# EAGLE design IotaWatt4.8 (EAGLE 7.7.0)
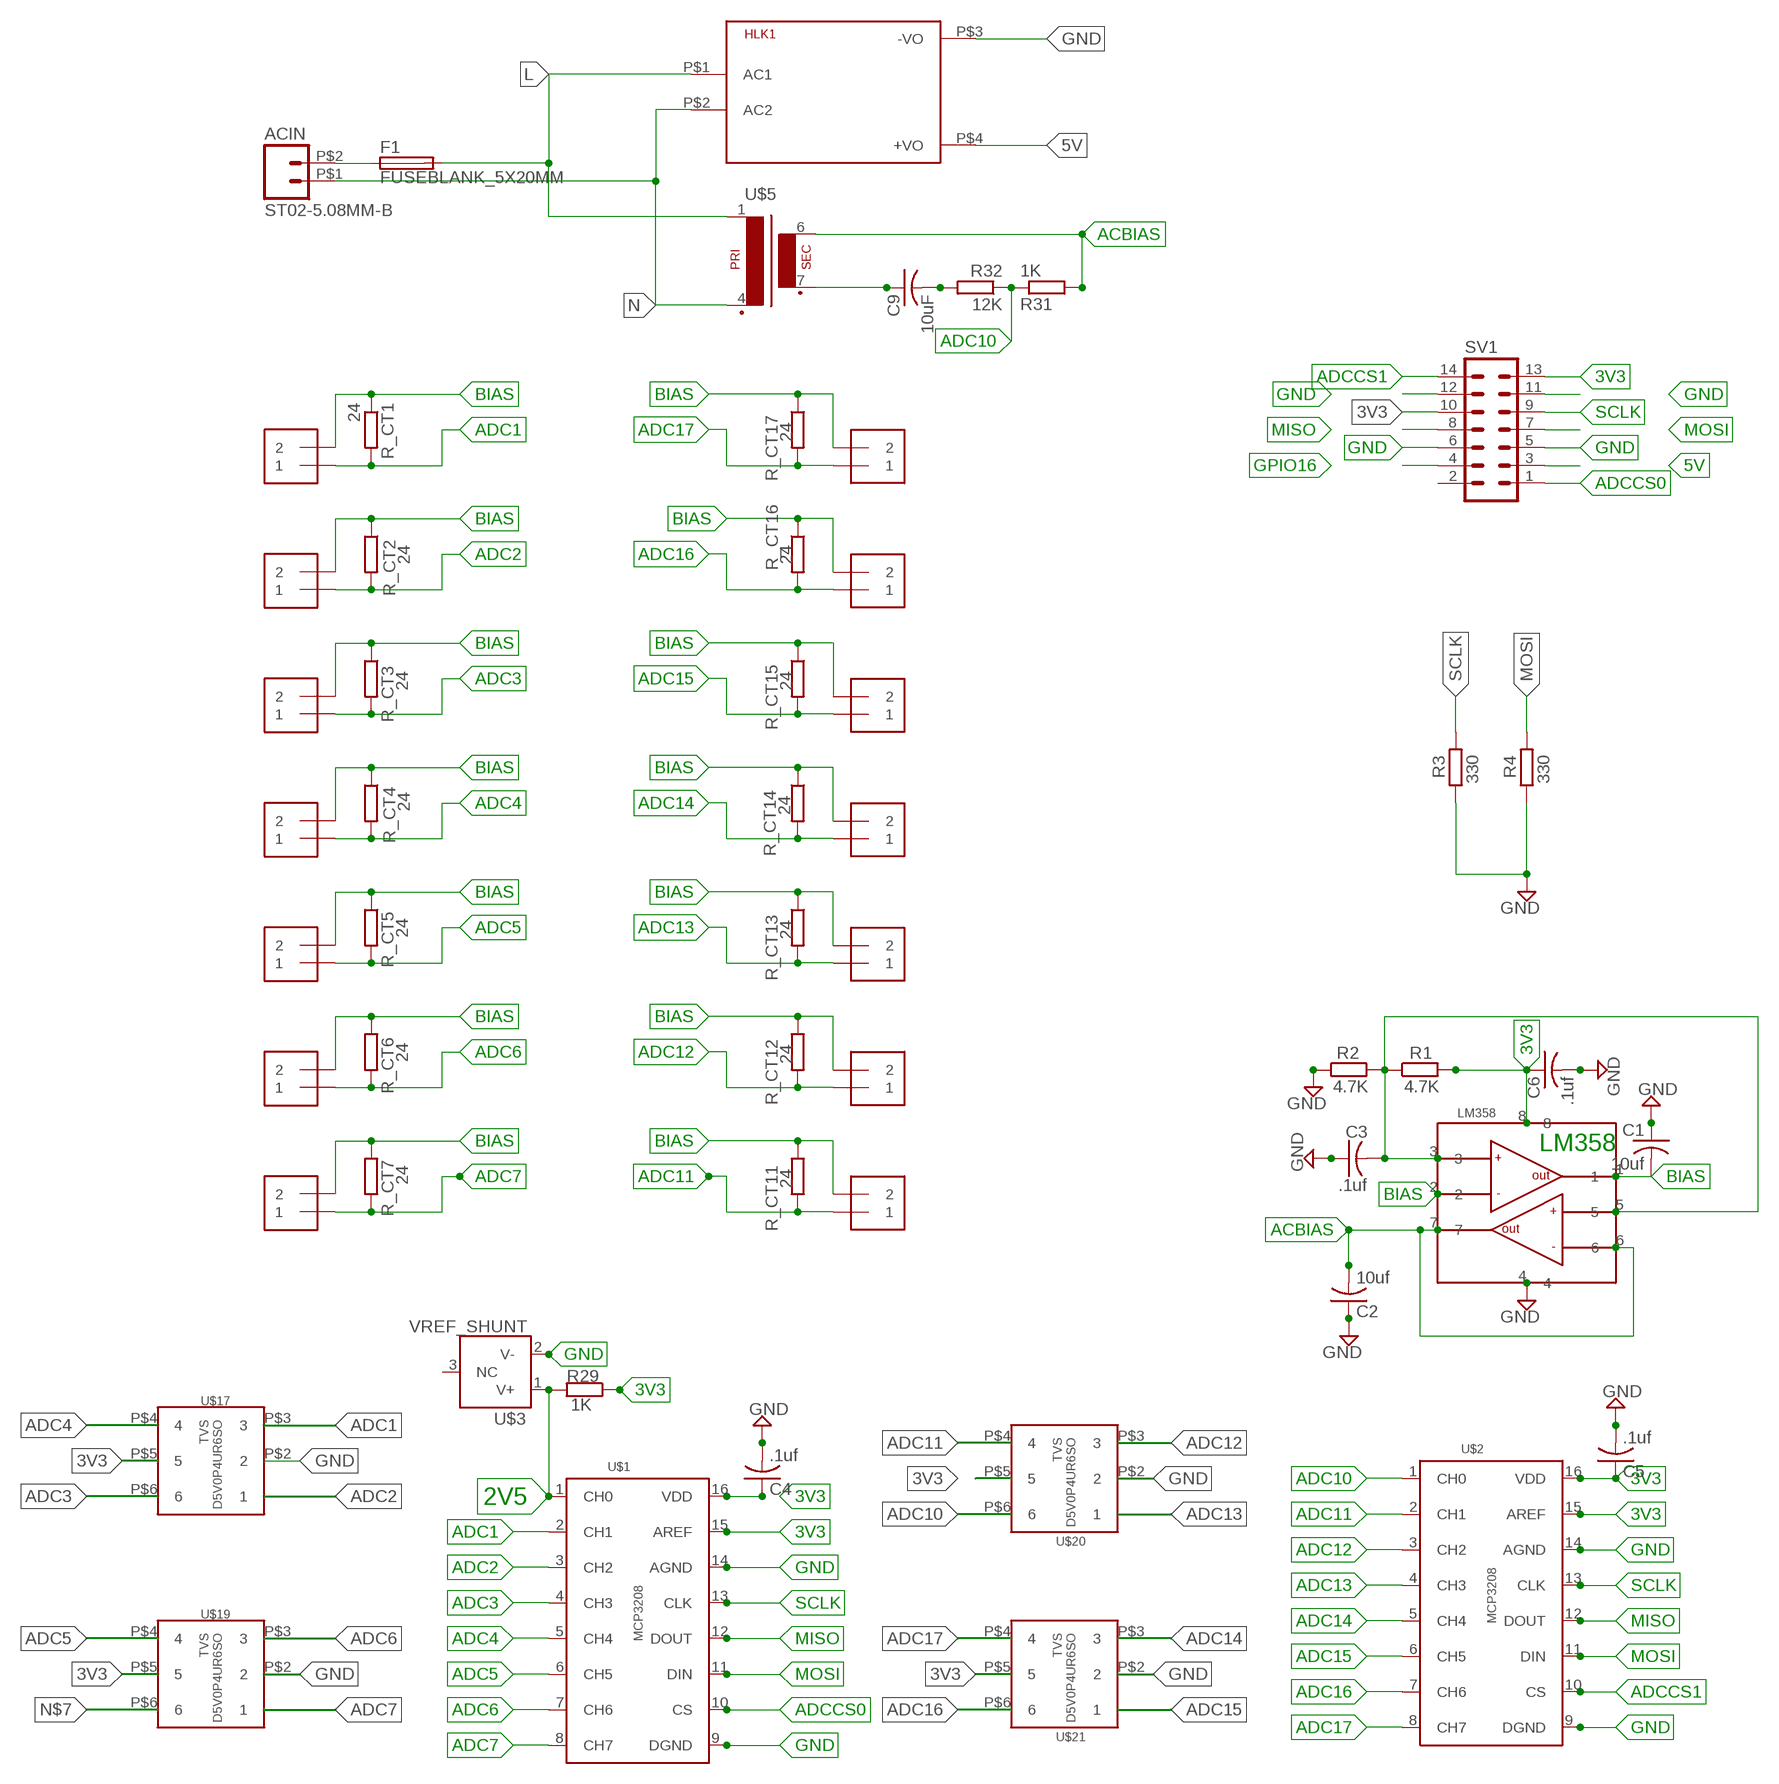
[diagram p0: schematic, sheet 1]

## Parts
ACIN  ST02-5.08MM-B  [EK500V4R-B]
C1  10uf  C-USC0805  [C0805]
C2  10uf  C-USC0805  [C0805]
C3  .1uf  C-USC0805  [C0805]
C4  .1uf  C-USC0805  [C0805]
C5  .1uf  C-USC0805  [C0805]
C6  .1uf  C-USC0805  [C0805]
C9  10uF  C-USC0805  [C0805]
CT1  1X2-3.5MM  [3.5MMTERM]
CT2  1X2-3.5MM  [3.5MMTERM]
CT3  1X2-3.5MM  [3.5MMTERM]
CT4  1X2-3.5MM  [3.5MMTERM]
CT5  1X2-3.5MM  [3.5MMTERM]
CT6  1X2-3.5MM  [3.5MMTERM]
CT7  1X2-3.5MM  [3.5MMTERM]
CT11  1X2-3.5MM  [3.5MMTERM]
CT12  1X2-3.5MM  [3.5MMTERM]
CT13  1X2-3.5MM  [3.5MMTERM]
CT14  1X2-3.5MM  [3.5MMTERM]
CT15  1X2-3.5MM  [3.5MMTERM]
CT16  1X2-3.5MM  [3.5MMTERM]
CT17  1X2-3.5MM  [3.5MMTERM]
F1  FUSEBLANK_5X20MM  [FUSE_HOLDER_5X20MM]
HLK1  HLK-PM013W  [HLK-PM01]
R1  4.7K  R-EU_R0805  [R0805]
R2  4.7K  R-EU_R0805  [R0805]
R3  330  R-EU_R0805  [R0805]
R4  330  R-EU_R0805  [R0805]
R29  1K  R-EU_R0805  [R0805]
R31  1K  R-EU_R0805  [R0805]
R32  12K  R-EU_R0805  [R0805]
R_CT1  24  R-EU_R0805  [R0805]
R_CT2  24  R-EU_R0805  [R0805]
R_CT3  24  R-EU_R0805  [R0805]
R_CT4  24  R-EU_R0805  [R0805]
R_CT5  24  R-EU_R0805  [R0805]
R_CT6  24  R-EU_R0805  [R0805]
R_CT7  24  R-EU_R0805  [R0805]
R_CT11  24  R-EU_R0805  [R0805]
R_CT12  24  R-EU_R0805  [R0805]
R_CT13  24  R-EU_R0805  [R0805]
R_CT14  24  R-EU_R0805  [R0805]
R_CT15  24  R-EU_R0805  [R0805]
R_CT16  24  R-EU_R0805  [R0805]
R_CT17  24  R-EU_R0805  [R0805]
SV1  MA07-2  [MA07-2]
U$1  MCP3208  [SOIC_16]
U$2  MCP3208  [SOIC_16]
U$3  VREF_SHUNT  [SOT23_3]
U$5  BV20_1P1S  [BV20]
U$17  TVS_4CHAN_ARRAYSC-74  [SC-74]
U$19  TVS_4CHAN_ARRAYSC-74  [SC-74]
U$20  TVS_4CHAN_ARRAYSC-74  [SC-74]
U$21  TVS_4CHAN_ARRAYSC-74  [SC-74]
U$22  LM358_DUAL_OP-AMP  [SOIC_8]

## Nets
2V5: R29.2 U$1.1(CH0) U$3.1(V+)
3V3: C4.1 C5.1 C6.1 R1.2 R29.1 SV1.10 SV1.13 U$1.15(AREF) U$1.16(VDD) U$2.15(AREF) U$2.16(VDD) U$17.P$5 U$19.P$5 U$20.P$5 U$21.P$5 U$22.8
5V: HLK1.P$4(+VO) SV1.3
ACBIAS: C2.2 R31.2 U$5.6(S4) U$22.6 U$22.7
ADC1: CT1.1 R_CT1.2 U$1.2(CH1) U$17.P$3
ADC2: CT2.1 R_CT2.2 U$1.3(CH2) U$17.P$1
ADC3: CT3.1 R_CT3.2 U$1.4(CH3) U$17.P$6
ADC4: CT4.1 R_CT4.2 U$1.5(CH4) U$17.P$4
ADC5: CT5.1 R_CT5.2 U$1.6(CH5) U$19.P$4
ADC6: CT6.1 R_CT6.2 U$1.7(CH6) U$19.P$3
ADC7: CT7.1 R_CT7.2 U$1.8(CH7) U$19.P$1
ADC10: R31.1 R32.1 U$2.1(CH0) U$20.P$6
ADC11: CT11.1 R_CT11.2 U$2.2(CH1) U$20.P$4
ADC12: CT12.1 R_CT12.2 U$2.3(CH2) U$20.P$3
ADC13: CT13.1 R_CT13.2 U$2.4(CH3) U$20.P$1
ADC14: CT14.1 R_CT14.2 U$2.5(CH4) U$21.P$3
ADC15: CT15.1 R_CT15.2 U$2.6(CH5) U$21.P$1
ADC16: CT16.1 R_CT16.2 U$2.7(CH6) U$21.P$6
ADC17: CT17.1 R_CT17.2 U$2.8(CH7) U$21.P$4
ADCCS0: SV1.1 U$1.10(CS)
ADCCS1: SV1.14 U$2.10(CS)
BIAS: C1.2 CT1.2 CT2.2 CT3.2 CT4.2 CT5.2 CT6.2 CT7.2 CT11.2 CT12.2 CT13.2 CT14.2 CT15.2 CT16.2 CT17.2 R_CT1.1 R_CT2.1 R_CT3.1 R_CT4.1 R_CT5.1 R_CT6.1 R_CT7.1 R_CT11.1 R_CT12.1 R_CT13.1 R_CT14.1 R_CT15.1 R_CT16.1 R_CT17.1 U$22.1 U$22.2
GND: C1.1 C2.1 C3.1 C4.2 C5.2 C6.2 HLK1.P$3(-VO) R2.1 R3.1 R4.1 SV1.5 SV1.6 SV1.11 SV1.12 U$1.9(DGND) U$1.14(AGND) U$2.9(DGND) U$2.14(AGND) U$3.2(V-) U$17.P$2 U$19.P$2 U$20.P$2 U$21.P$2 U$22.4
GPIO16: SV1.4
L: F1.2 HLK1.P$1(AC1) U$5.1
MISO: SV1.8 U$1.12(DOUT) U$2.12(DOUT)
MOSI: R4.2 SV1.7 U$1.11(DIN) U$2.11(DIN)
N: ACIN.P$1 HLK1.P$2(AC2) U$5.4(P2)
N$2: ACIN.P$2 F1.1
N$7: U$19.P$6
N$17: C9.2 R32.2
N$27: C9.1 U$5.7(S3)
SCLK: R3.2 SV1.9 U$1.13(CLK) U$2.13(CLK)
VREF: C3.2 R1.1 R2.2 U$22.3 U$22.5
Unconnected: SV1.2 U$3.3(NC)

## Notes on the sheet
- LM358

## Library data of the parts
ACIN = con-dinkle:ST02: Dinkle® Screw Terminal Block - 2 Way -5MM: EK500V series. Rated at 20A, 300VAC. Cable size: 2mm² Supplier: Altronics P2034A Source: http://www.dinkle.com/upfiles/proter21253708953.pdf -5.08MM: The back half of a EK500V4R-04P. Rated at 20A, 300VAC. Cable size: 2mm² Supplier: Altronics P2024 (half of) Source: http://www.dinkle.com/upfiles/proter21253708833.pdf -3.5MM: ED350V series. Rated at 10A, 300VAC. Cable size: 1.4mm² Supplier: Altronics P2028 Source: http://www.dinkle.com/upfiles/proter21253714491.pdf
C1-C6 C9 = adafruit:C-US: CAPACITOR, American symbol
CT1-CT7 CT11-CT17 = adafruit:1X2: 3.5mm Terminal block http://www.ladyada.net/library/pcb/eaglelibrary.html
F1 = fuse:FUSE: Fuse; OC_FARNELL: unknown; OC_NEWARK: unknown
HLK1 = HLK-PM01:HLK-PM01: Hi-Link Power Supply HLK-PM01 3W Author: Ahmed Said <https://github.com/AhmedSaid/EAGLELibraries>
R1-R4 R29 R31 R32 R_CT1-R_CT7 R_CT11-R_CT17 = resistor:R-EU_: RESISTOR, European symbol
SV1 = con-lstb:MA07-2: PIN HEADER; OC_FARNELL: unknown; OC_NEWARK: unknown
U$1 U$2 = IotaWatt_parts:MCP3208: MCP3208 12bit SPI ADC
U$3 = IotaWatt_parts:VREF_SHUNT: Voltage Reference Shunt - SOT23-3 (ADR504, etc.)
U$5 = bv_20:BV20_1P1S
U$17 U$19-U$21 = IotaWatt_parts:TVS_4CHAN_ARRAY: TVS 4 channel array
U$22 = IotaWatt_parts:LM358_DUAL_OP-AMP: LM358 Dual Op-Amp - SOIC8

## Board
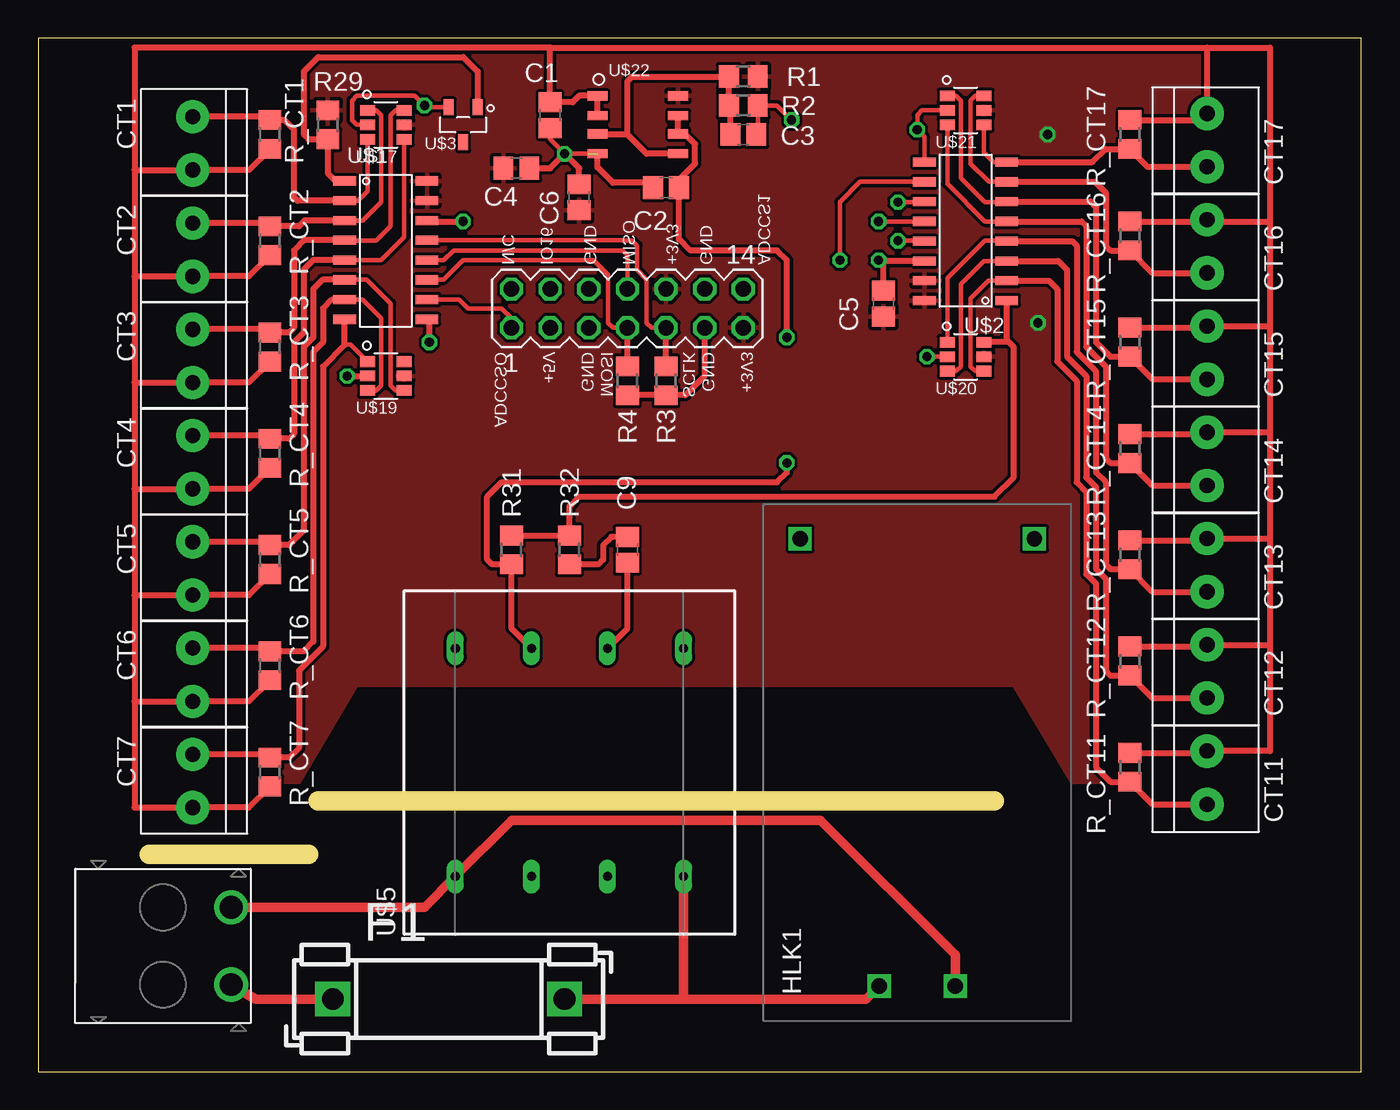
[diagram p1: board, top side]
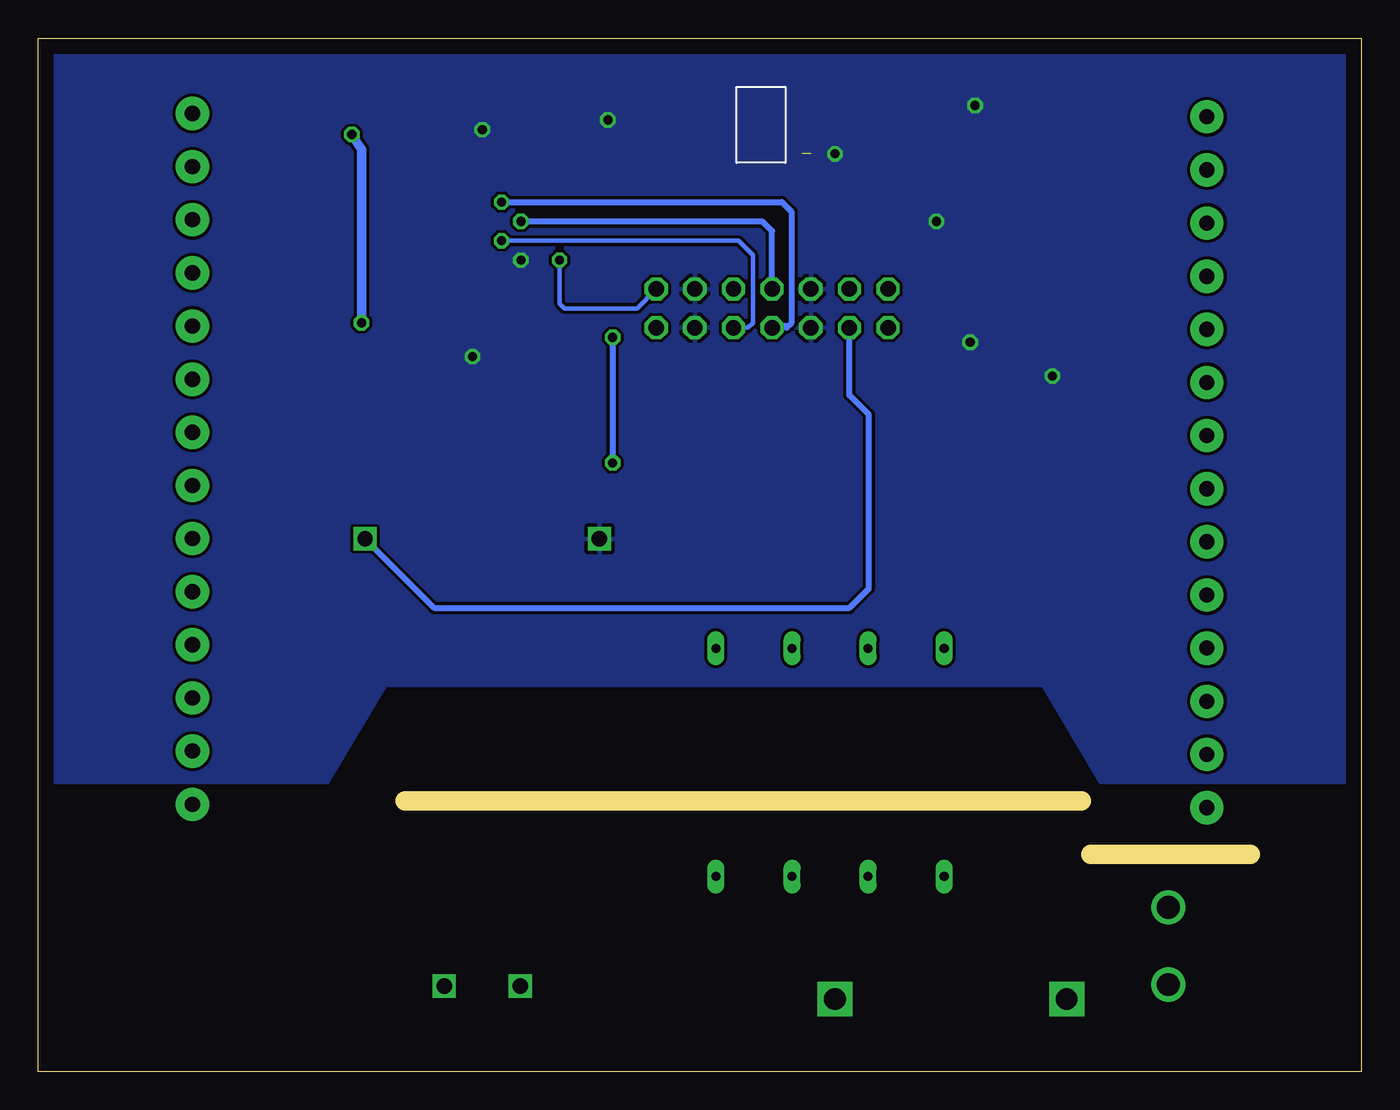
[diagram p2: board, bottom side, seen from below]

Size 86.98 x 67.94 mm. Coordinates in mm from the lower left corner, seen from the top.
Outline: 0,0 86.98,0 86.98,67.94 0,67.94 0,0
Copper layers (1*16): Top 0.035mm / dielectric 1.5mm / Bottom 0.035mm
Design rules "default": minimum track width 10mil, minimum drill 24mil, track to track 8mil, track to pad 8mil, pad to pad 8mil, via to via 8mil, smd to smd 8mil, copper to edge 40mil, drill to drill 8mil, minimum pad ring 10mil, minimum via ring 8mil, stop-mask expansion 4mil, vias tented up to drill 0mil, thermal gap 10mil
Milling: 2 lines

### Footprints (pad centres in the part's own frame; a part is rotated, then mirrored left to right if it is on the bottom)
EK500V4R-B = drill 1.5: P$1 2.54,15.24; P$2 7.62,15.24
C0805 = smd 1.3 x 1.5: 1 -0.85,0; 2 0.85,0
3.5MMTERM = drill 1 pad 2.184: 1 1.8,0; 2 -1.7,0
FUSE_HOLDER_5X20MM = drill 1.422 pad 2.286 square: 1 0,0; 2 15.24,0
HLK-PM01 = drill 1.016 square: P$1 -14.7,2.5; P$2 -14.7,-2.5; P$3 14.7,7.7; P$4 14.7,-7.7
R0805 = smd 1.3 x 1.5: 1 -0.95,0; 2 0.95,0
MA07-2 = drill 1.016 octagon: 1 -7.62,-1.27; 2 -7.62,1.27; 3 -5.08,-1.27; 4 -5.08,1.27; 5 -2.54,-1.27; 6 -2.54,1.27; 7 0,-1.27; 8 0,1.27; 9 2.54,-1.27; 10 2.54,1.27; 11 5.08,-1.27; 12 5.08,1.27; 13 7.62,-1.27; 14 7.62,1.27
SOIC_16 = smd 1.5 x 0.6: 1 -2.7,5.2; 2 -2.7,3.9; 3 -2.7,2.6; 4 -2.7,1.3; 5 -2.7,0; 6 -2.7,-1.3; 7 -2.7,-2.6; 8 -2.7,-3.9; 9 2.7,-3.9; 10 2.7,-2.6; 11 2.7,-1.3; 12 2.7,0; 13 2.7,1.3; 14 2.7,2.6; 15 2.7,3.9; 16 2.7,5.2
SOT23_3 = smd 1.05 x 0.65: 1 -1.15,0.95; 2 -1.15,-0.95; 3 1.15,0
BV20 = drill 0.6 long: 1 -7.5,-7.5; 2 -7.5,-2.5; 3 -7.5,2.5; 4 -7.5,7.5; 5 7.5,7.5; 6 7.5,2.5; 7 7.5,-2.5; 8 7.5,-7.5
SC-74 = smd 1 x 0.7: P$1 -1.2,0.95; P$2 -1.2,0; P$3 -1.2,-0.95; P$4 1.2,-0.95; P$5 1.2,0; P$6 1.2,0.95
SOIC_8 = smd 1.3 x 0.6: 1 -2.6,1.9; 2 -2.6,0.6; 3 -2.6,-0.6; 4 -2.6,-1.9; 5 2.7,-1.9; 6 2.7,-0.6; 7 2.7,0.6; 8 2.7,1.9

### Placement (x,y rotation side)
ACIN  -2.54,13.34 270 top
C1  33.66,62.87 90 top
C2  41.27,58.1 0 top
C3  46.36,61.59 180 top
C4  31.43,59.37 0 top
C5  55.56,50.48 90 top
C6  35.56,57.47 90 top
C9  38.73,34.29 90 top
CT1  10.16,60.96 90 top
CT2  10.16,53.98 90 top
CT3  10.16,46.99 90 top
CT4  10.16,40.01 90 top
CT5  10.16,33.02 90 top
CT6  10.16,26.04 90 top
CT7  10.16,19.05 90 top
CT11  76.83,19.37 270 top
CT12  76.83,26.35 270 top
CT13  76.83,33.34 270 top
CT14  76.83,40.32 270 top
CT15  76.83,47.31 270 top
CT16  76.83,54.29 270 top
CT17  76.83,61.28 270 top
F1  19.37,4.76 0 top
HLK1  57.79,20.32 90 top
R1  46.36,65.41 0 top
R2  46.36,63.5 180 top
R3  41.27,45.4 90 top
R4  38.73,45.4 90 top
R29  19.05,62.23 270 top
R31  31.11,34.29 270 top
R32  34.93,34.29 270 top
R_CT1  15.24,61.59 90 top
R_CT2  15.24,54.61 90 top
R_CT3  15.24,47.62 90 top
R_CT4  15.24,40.64 90 top
R_CT5  15.24,33.66 90 top
R_CT6  15.24,26.67 90 top
R_CT7  15.24,19.68 90 top
R_CT11  71.75,20 270 top
R_CT12  71.75,26.99 270 top
R_CT13  71.75,33.97 270 top
R_CT14  71.75,40.96 270 top
R_CT15  71.75,47.94 270 top
R_CT16  71.75,54.93 270 top
R_CT17  71.75,61.59 270 top
SV1  38.73,50.16 0 top
U$1  22.86,53.34 0 top
U$2  60.96,55.88 180 top
U$3  27.94,62.23 270 top
U$5  34.93,20.32 90 top
U$17  22.86,62.23 0 top
U$19  22.86,45.72 0 top
U$20  60.96,46.99 0 top
U$21  60.96,63.18 0 top
U$22  39.37,62.23 0 top

### Tracks (layer width: path | path; a pad name or v marks a point on that pad's centre or on a via)
2V5
  Top 0.406: U$1.1 19.56,58.54 19.05,59.05 R29.2 17.78,61.28 17.46,61.59 17.46,65.72 18.41,66.67 27.94,66.67 28.89,65.72 U$3.1
3V3  (via drill 0.6)
  Bottom 0.61: v65.72,49.21 65.72,60.64 v66.36,61.59
  pour Top: 0,67.94 86.99,67.94 86.99,19.05 67.94,19.05 64.13,25.4 20.95,25.4 17.14,19.05 0,19.05
5V
  Bottom 0.406: HLK1.P$4 60.95,30.48 33.66,30.48 32.39,31.75 32.39,43.18 33.66,44.45 SV1.3
ACBIAS  (via drill 0.6)
  Top 0.406: U$22.7 U$22.6 42.51,61.63 43.18,60.96 43.18,59.69 42.12,58.63 C2.2 42.12,54.71 42.86,53.98 48.58,53.98 49.21,53.34 v49.21,48.26 | U$5.6 31.11,29.13 R31.2 29.84,33.34 29.53,33.66 29.53,37.78 30.48,38.73 48.58,38.73 49.21,39.37 v49.21,40.01
  Bottom 0.406: v49.21,48.26 v49.21,40.01
ADC1
  Top 0.305: U$17.P$3 21.66,57.85 21.04,57.24 U$1.2
  Top 0.406: CT1.1 15.03,62.76 R_CT1.2 16.19,62.55 16.83,61.91 16.83,57.47 17.05,57.24 U$1.2
ADC2
  Top 0.305: U$17.P$1 22.23,63.18 22.54,62.87 22.54,57.15 21.33,55.94 U$1.3
  Top 0.406: CT2.1 15.03,55.77 R_CT2.2 17.14,55.56 17.52,55.94 U$1.3
ADC3
  Top 0.305: U$17.P$6 23.49,63.18 23.18,62.87 23.18,55.56 22.22,54.61 20.19,54.61 U$1.4
  Top 0.406: CT3.1 15.03,48.79 R_CT3.2 16.51,48.58 16.83,48.9 16.83,53.98 17.49,54.64 U$1.4
ADC4
  Top 0.305: U$17.P$4 24.06,54.86 22.54,53.34 U$1.5
  Top 0.406: CT4.1 15.03,41.8 R_CT4.2 16.51,41.59 16.83,41.91 16.83,47.94 17.46,48.58 17.46,52.7 18.1,53.34 U$1.5
ADC5
  Top 0.305: U$19.P$4 23.49,44.77 23.18,45.09 23.18,50.48 21.59,52.07 20.19,52.07 U$1.6
  Top 0.406: CT5.1 15.03,34.82 R_CT5.2 16.51,34.61 17.46,35.56 17.46,47.62 18.1,48.26 18.1,51.44 18.7,52.04 U$1.6
ADC6
  Top 0.305: U$19.P$3 22.23,44.77 22.54,45.09 22.54,49.53 21.33,50.74 U$1.7
  Top 0.406: CT6.1 15.03,27.84 R_CT6.2 17.46,27.62 18.1,28.26 18.1,47.31 18.73,47.94 18.73,50.16 19.31,50.74 U$1.7
ADC7
  Top 0.305: U$19.P$1 20.55,47.78 20.16,47.78
  Top 0.406: CT7.1 15.03,20.85 R_CT7.2 16.51,20.64 17.14,21.27 17.14,26.35 18.73,27.94 18.73,46.35 20.16,47.78 U$1.8
ADC10
  Top 0.406: R31.1 R32.1 34.93,37.15 35.56,37.78 62.87,37.78 64.13,39.05 64.13,47.62 63.82,47.94 | 63.82,47.94 U$20.P$6 | U$2.1 63.66,48.1 63.82,47.94
ADC11
  Top 0.305: U$20.P$4 61.59,46.04 61.28,46.35 61.28,50.8 62.46,51.98 U$2.2
  Top 0.406: CT11.1 73.24,17.57 R_CT11.2 70.48,19.05 69.53,20 69.53,32.07 68.9,32.7 68.9,38.1 68.26,38.73 68.26,45.4 66.99,46.67 66.99,51.44 66.45,51.98 U$2.2
ADC12
  Top 0.305: U$20.P$3 60.33,46.04 60.64,46.35 60.64,51.75 62.17,53.28 U$2.3
  Top 0.406: CT12.1 73.24,24.55 R_CT12.2 70.48,26.04 70.17,26.35 70.17,32.38 69.53,33.02 69.53,38.42 68.9,39.05 68.9,45.72 67.63,46.99 67.63,52.7 67.05,53.28 U$2.3
ADC13
  Top 0.305: U$20.P$1 59.76,52.14 62.23,54.61 63.63,54.61 U$2.4
  Top 0.406: CT13.1 73.24,31.54 R_CT13.2 70.48,33.02 70.17,33.34 70.17,38.73 69.53,39.37 69.53,46.04 68.26,47.31 68.26,54.29 67.97,54.58 U$2.4
ADC14
  Top 0.305: U$21.P$3 59.76,58.35 62.23,55.88 U$2.5
  Top 0.406: CT14.1 73.24,38.52 R_CT14.2 70.48,40.01 70.17,40.32 70.17,46.35 68.9,47.62 68.9,55.56 68.58,55.88 U$2.5
ADC15
  Top 0.305: U$21.P$1 60.33,64.13 60.64,63.82 60.64,58.74 62.23,57.15 63.63,57.15 U$2.6
  Top 0.406: CT15.1 73.24,45.51 R_CT15.2 70.48,46.99 69.53,47.94 69.53,56.83 69.18,57.18 U$2.6
ADC16
  Top 0.305: U$21.P$6 61.59,64.13 61.28,63.82 61.28,59.69 62.49,58.48 U$2.7
  Top 0.406: CT16.1 73.24,52.49 R_CT16.2 70.48,53.98 70.17,54.29 70.17,57.78 69.47,58.48 U$2.7
ADC17
  Top 0.305: U$21.P$4 62.16,60.4 62.77,59.78 U$2.8
  Top 0.406: CT17.1 72.92,59.48 R_CT17.2 70.17,60.64 69.3,59.78 U$2.8
ADCCS0
  Top 0.305: U$1.10 27.68,50.74 28.26,50.16 30.48,50.16 31.11,49.53 SV1.1
ADCCS1  (via drill 0.6)
  Top 0.305: U$2.10 54.04,58.48 52.71,57.15 v52.71,53.34
  Bottom 0.305: v52.71,53.34 52.71,50.48 52.39,50.16 47.62,50.16 SV1.14
BIAS
  Top 0.406: R_CT2.1 13.86,52.27 CT2.2 6.35,52.27 | R_CT4.1 13.86,38.3 CT4.2 6.35,38.3 | R_CT5.1 13.86,31.32 CT5.2 6.35,31.32 | R_CT6.1 13.86,24.34 CT6.2 6.35,24.34 | R_CT7.1 13.86,17.35 CT7.2 6.35,17.35 6.35,24.34 | R_CT1.1 13.86,59.26 CT1.2 6.35,59.26 | R_CT3.1 13.86,45.29 CT3.2 6.35,45.29 | 33.66,67.31 6.35,67.31 6.35,59.26 | 6.35,59.26 6.35,52.27 | 6.35,52.27 6.35,45.29 | 6.35,45.29 6.35,38.3 | 6.35,38.3 6.35,31.32 | 6.35,31.32 6.35,24.34 | U$22.2 U$22.1 35.55,64.13 35.14,63.72 C1.2 33.66,67.31 | 33.66,67.31 76.83,67.31 | 76.83,67.31 80.96,67.31 80.96,55.88 | 80.96,55.88 80.96,49.01 | 80.96,49.01 80.96,42.02 | 80.96,42.02 80.96,35.04 | 80.96,35.04 80.96,28.05 | 80.96,28.05 80.96,21.07 CT11.2 76.72,20.95 R_CT11.1 | 80.96,28.05 CT12.2 76.72,27.94 R_CT12.1 | 80.96,35.04 CT13.2 76.72,34.92 R_CT13.1 | 80.96,42.02 CT14.2 76.72,41.91 R_CT14.1 | 80.96,49.01 CT15.2 76.72,48.89 R_CT15.1 | CT16.2 76.2,55.99 76.2,55.88 | 76.2,55.88 80.96,55.88 | 76.83,67.31 CT17.2 76.4,62.55 R_CT17.1 | R_CT16.1 76.2,55.88
GND  (via drill 0.6)  (1 unrouted)
  Top 0.305: U$17.P$2 20.95,62.23 20.64,62.55 20.64,63.82 20.95,64.14 24.76,64.14 v25.4,63.5 25.52,63.38 U$3.2 | C1.1 33.66,61.28 v34.61,60.33 36.2,60.33 | C2.1 40.32,58.42 | U$22.4 | v49.53,62.55 48.58,63.5 R2.1 47.3,61.7 C3.1 | U$21.P$2 58.1,63.18 57.79,62.87 v57.79,61.91 58.26,61.44 U$2.9 | U$20.P$2 v58.42,46.99
  Top 0.406: C4.2 33.66,59.37 v34.61,60.33 35.56,59.37 C6.2 | v20.32,45.72 U$19.P$2 | U$2.14 55.3,53.28 v55.25,53.34 55.56,53.02 C5.2 | 40.32,58.42 37.78,58.42 36.77,59.43 U$22.4 | U$1.9 25.72,49.28 v25.72,47.94 | U$1.14 25.62,55.88 v27.94,55.88 | SV1.11 43.82,45.72 42.55,44.45 R3.1 R4.1
  pour Bottom: 0,68.58 87.63,68.58 87.63,19.05 67.94,19.05 64.13,25.4 20.95,25.4 17.14,19.05 0,19.05
L
  Top 0.61: F1.2 42.55,4.76 | 42.55,4.76 54.43,4.76 HLK1.P$1 | U$5.1 42.43,4.88 42.55,4.76
MISO  (via drill 0.6)
  Top 0.305: U$1.12 26.67,53.34 27.3,53.98 38.42,53.98 38.73,53.66 SV1.8 | U$2.12 v55.25,55.88
  Bottom 0.406: SV1.8 38.73,55.24 39.37,55.88 v55.25,55.88
MOSI  (via drill 0.6)
  Top 0.305: U$1.11 26.64,52.04 27.94,53.34 36.51,53.34 37.47,52.39 37.47,49.21 37.78,48.9 SV1.7 | U$2.11 58.23,57.15 v56.52,57.15
  Top 0.406: R4.2 SV1.7
  Bottom 0.305: 37.47,49.21 37.62,49.05 38.58,49.05 SV1.7
  Bottom 0.406: v56.52,57.15 38.1,57.15 37.47,56.52 37.47,49.21 37.78,48.9 SV1.7
N
  Top 0.61: ACIN.P$1 25.4,10.79 U$5.4 31.11,16.51 51.44,16.51 60.29,7.66 HLK1.P$2
N$2
  Top 0.61: ACIN.P$2 14.29,4.76 F1.1
N$17
  Top 0.406: C9.2 37.68,35.14 37.15,34.61 37.15,33.66 36.83,33.34 R32.2
N$27
  Top 0.406: U$5.7 38.73,29.13 C9.1
SCLK  (via drill 0.6)
  Top 0.305: U$1.13 38.39,54.64 38.42,54.61 39.05,54.61 39.37,54.29 39.37,52.7 40.01,52.07 40.01,49.21 40.32,48.9 SV1.9 | U$2.13 58.23,54.61 v56.52,54.61
  Top 0.406: R3.2 SV1.9
  Bottom 0.305: v56.52,54.61 40.96,54.61 40.01,53.66 40.01,49.21 40.32,48.9 SV1.9
VREF
  Top 0.406: U$22.3 38.7,61.63 38.73,61.59 | U$22.5 40,60.33 38.73,61.59 | 38.73,61.59 38.73,65.09 39.05,65.41 R1.1 R2.2 45.51,63.4 C3.2

### Text on the board
tNames: N/C | IO16 | GND | MISO | +3V3 | GND | ADCCS1 | ADCCSO | +5V | GND | MOSI | SCLK | GND | +3V3